# Altium schematic sheet DM3390_Connector_A.SchDoc: =project_title
size Tabloid; CompanyName: Luxonis Holding; Organization: Luxonis Holding; Address1: 1925 Harmony Park Drive; Address2: Westminster, CO; Address3: 80234; Address4: United States; SheetNumber: 7; SheetTotal: 12
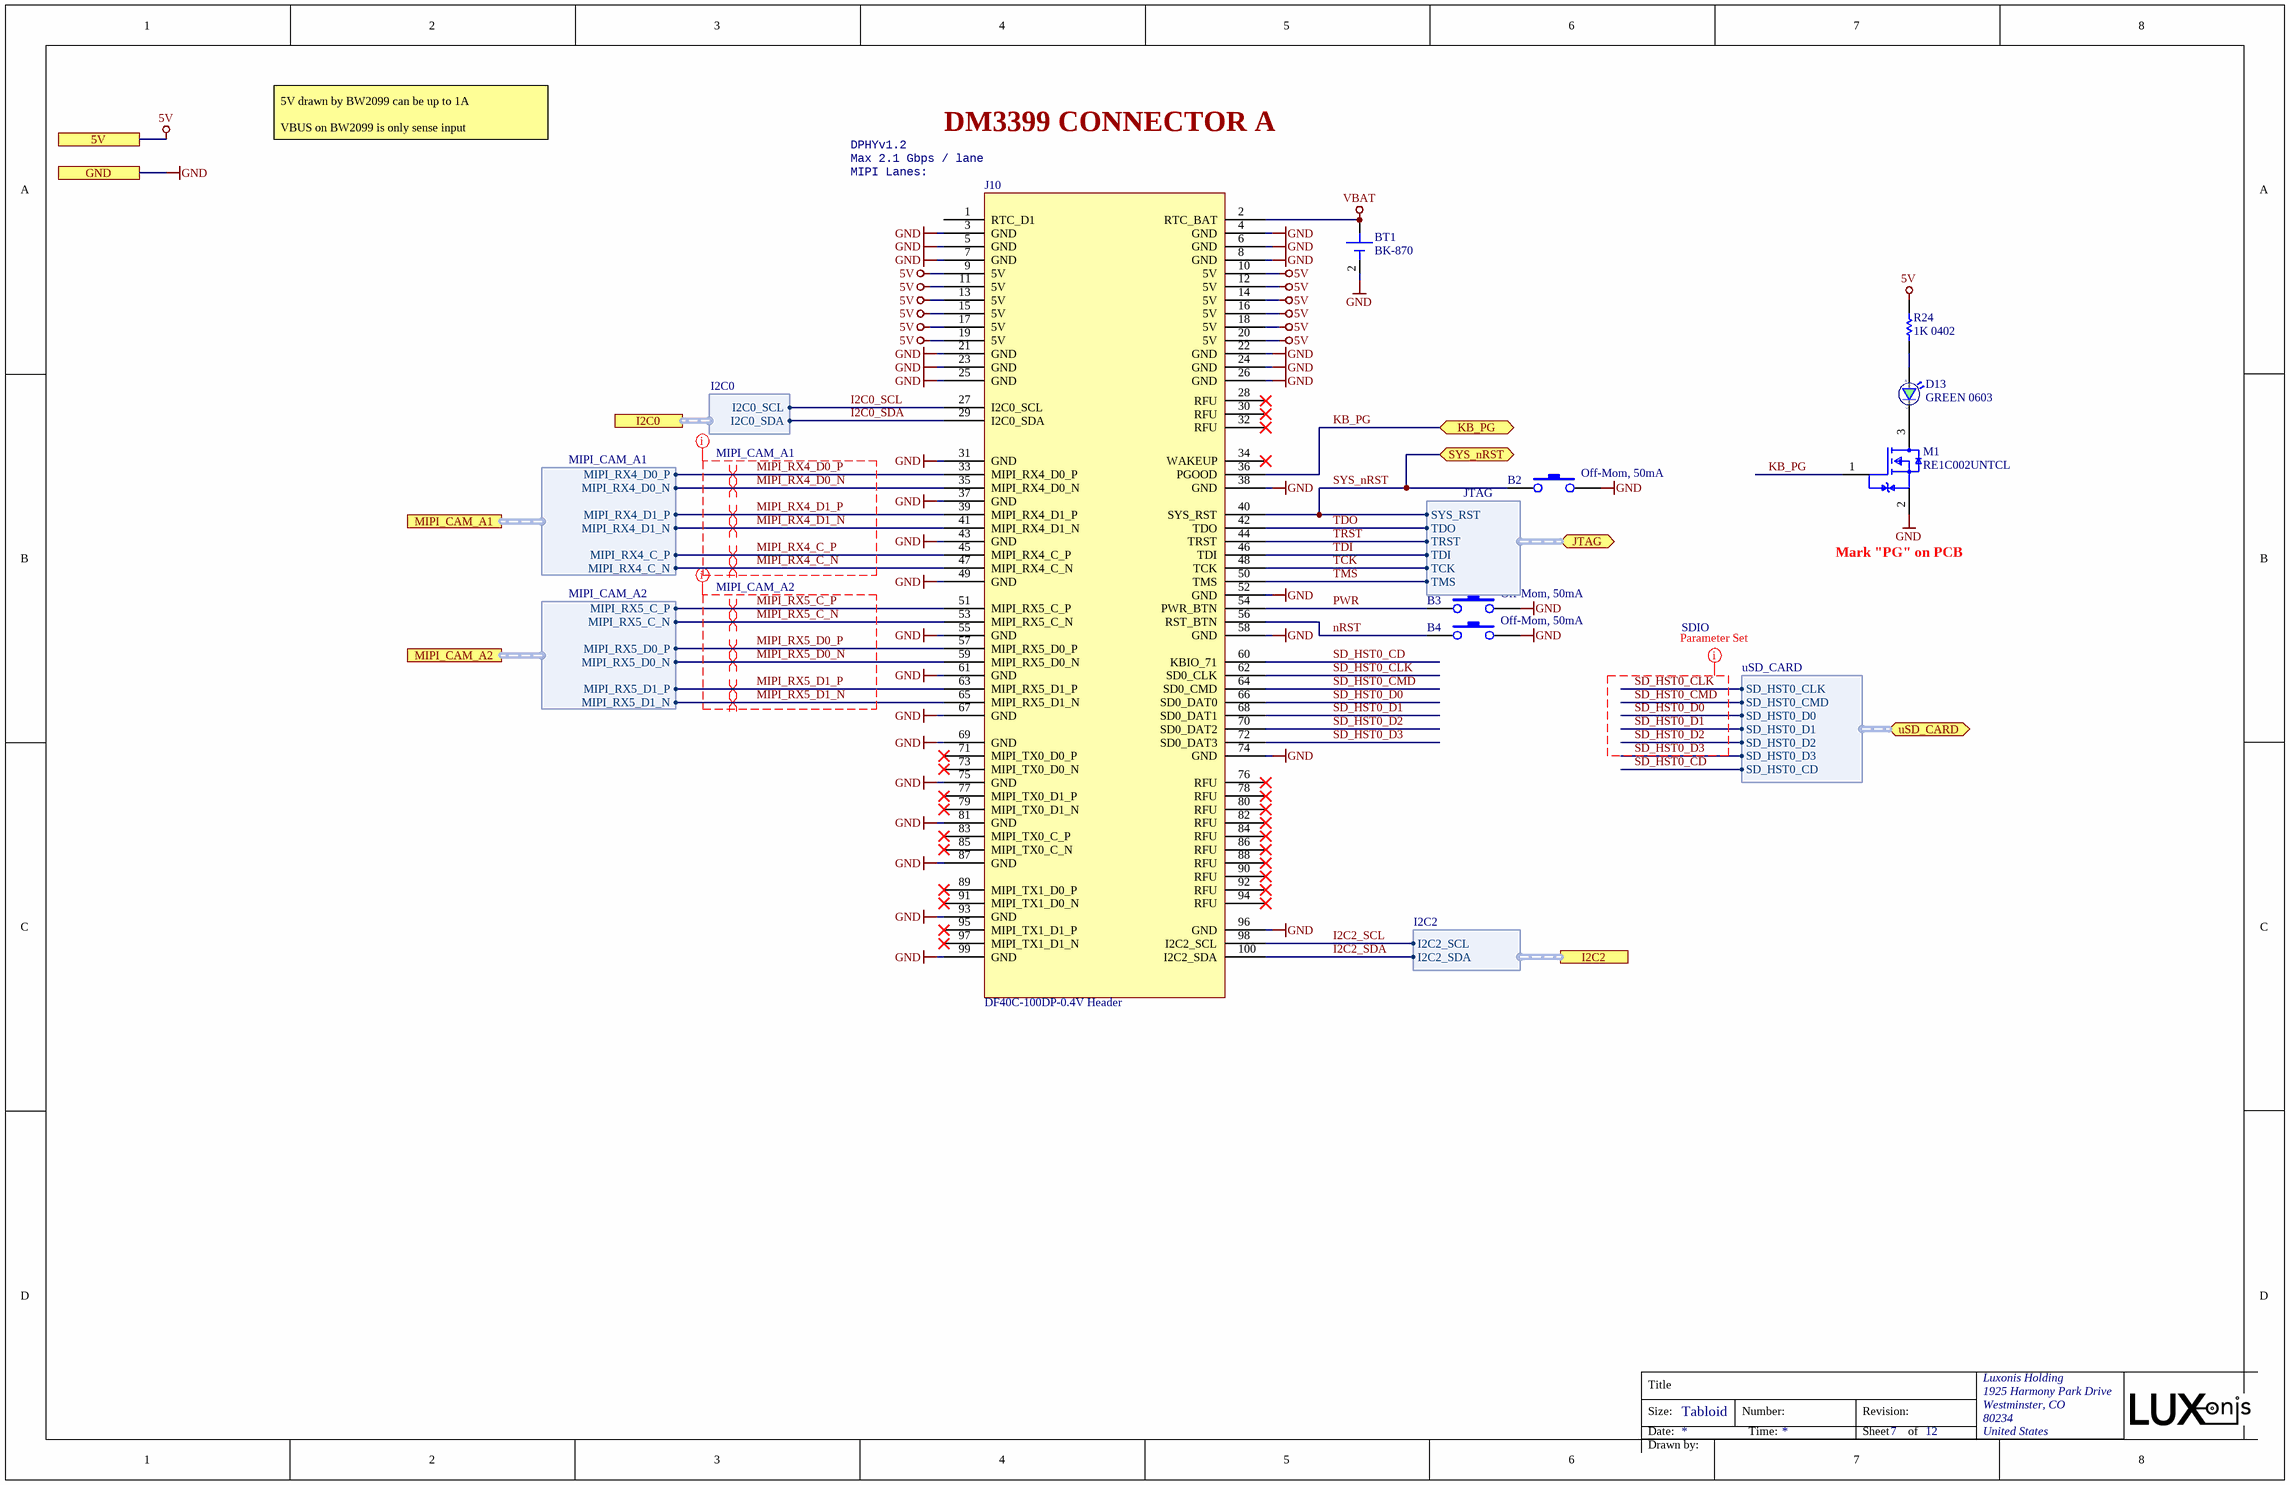
[diagram p0: DM3390_Connector_A.SchDoc]

## Parts
B2  Off-Mom, 50mA  [DTSM-32N-V]
B3  Off-Mom, 50mA  [DTSM-32N-V]
B4  Off-Mom, 50mA  [DTSM-32N-V]
BT1  BK-870  [MPD_BK-870]
D13  GREEN 0603  [SML_D1xx8W]
J10  DF40C-100DP-0.4V Header  [CON_A_SoM-MAX_DF40HC-3.0-100DS-0.4V_minpad]
M1  RE1C002UNTCL  [RE1C002UNTCL]
R24  1K 0402  [RESC0402(1005)_N]

## Ports
5V, GND, I2C0 (harness I2C0), I2C2 (harness I2C2), JTAG (bidir, harness JTAG), KB_PG (bidir), MIPI_CAM_A1 (harness MIPI_CAM_A1), MIPI_CAM_A2 (harness MIPI_CAM_A2), SYS_nRST (bidir), uSD_CARD (bidir, harness uSD_CARD)

## Harnesses
MIPI_CAM_A1: MIPI_RX4_D0_P, MIPI_RX4_D0_N, MIPI_RX4_D1_P, MIPI_RX4_D1_N, MIPI_RX4_C_P, MIPI_RX4_C_N
uSD_CARD: SD_HST0_CLK, SD_HST0_CMD, SD_HST0_D0, SD_HST0_D1, SD_HST0_D2, SD_HST0_D3, SD_HST0_CD
I2C2: I2C2_SDA, I2C2_SCL
MIPI_CAM_A2: MIPI_RX5_C_P, MIPI_RX5_C_N, MIPI_RX5_D0_P, MIPI_RX5_D0_N, MIPI_RX5_D1_P, MIPI_RX5_D1_N
I2C0: I2C0_SCL, I2C0_SDA
JTAG: SYS_RST, TDO, TRST, TDI, TCK, TMS

## Nets
5V: J10.9(5V) J10.10(5V) J10.11(5V) J10.12(5V) J10.13(5V) J10.14(5V) J10.15(5V) J10.16(5V) J10.17(5V) J10.18(5V) J10.19(5V) J10.20(5V) R24.2 ; port 5V
GND: B2.1 B3.1 B4.1 BT1.2(M) J10.3(GND) J10.4(GND) J10.5(GND) J10.6(GND) J10.7(GND) J10.8(GND) J10.21(GND) J10.22(GND) J10.23(GND) J10.24(GND) J10.25(GND) J10.26(GND) J10.31(GND) J10.37(GND) J10.38(GND) J10.43(GND) J10.49(GND) J10.52(GND) J10.55(GND) J10.58(GND) J10.61(GND) J10.67(GND) J10.69(GND) J10.74(GND) J10.75(GND) J10.81(GND) J10.87(GND) J10.93(GND) J10.96(GND) J10.99(GND) M1.2(Source) ; port GND
VBAT: BT1.1(P) BT1.3(P) J10.2(RTC_BAT)
I2C0_SCL: J10.27(I2C0_SCL) ; port I2C0.I2C0_SCL
I2C0_SDA: J10.29(I2C0_SDA) ; port I2C0.I2C0_SDA
I2C2_SCL: J10.98(I2C2_SCL) ; port I2C2.I2C2_SCL
I2C2_SDA: J10.100(I2C2_SDA) ; port I2C2.I2C2_SDA
KB_PG: J10.36(PGOOD) M1.1(Gate) ; port KB_PG
MIPI_RX4_C_N: J10.47(MIPI_RX4_C_N) ; port MIPI_CAM_A1.MIPI_RX4_C_N
MIPI_RX4_C_P: J10.45(MIPI_RX4_C_P) ; port MIPI_CAM_A1.MIPI_RX4_C_P
MIPI_RX4_D0_N: J10.35(MIPI_RX4_D0_N) ; port MIPI_CAM_A1.MIPI_RX4_D0_N
MIPI_RX4_D0_P: J10.33(MIPI_RX4_D0_P) ; port MIPI_CAM_A1.MIPI_RX4_D0_P
MIPI_RX4_D1_N: J10.41(MIPI_RX4_D1_N) ; port MIPI_CAM_A1.MIPI_RX4_D1_N
MIPI_RX4_D1_P: J10.39(MIPI_RX4_D1_P) ; port MIPI_CAM_A1.MIPI_RX4_D1_P
MIPI_RX5_C_N: J10.53(MIPI_RX5_C_N) ; port MIPI_CAM_A2.MIPI_RX5_C_N
MIPI_RX5_C_P: J10.51(MIPI_RX5_C_P) ; port MIPI_CAM_A2.MIPI_RX5_C_P
MIPI_RX5_D0_N: J10.59(MIPI_RX5_D0_N) ; port MIPI_CAM_A2.MIPI_RX5_D0_N
MIPI_RX5_D0_P: J10.57(MIPI_RX5_D0_P) ; port MIPI_CAM_A2.MIPI_RX5_D0_P
MIPI_RX5_D1_N: J10.65(MIPI_RX5_D1_N) ; port MIPI_CAM_A2.MIPI_RX5_D1_N
MIPI_RX5_D1_P: J10.63(MIPI_RX5_D1_P) ; port MIPI_CAM_A2.MIPI_RX5_D1_P
nRST: B4.2 J10.56(RST_BTN)
PWR: B3.2 J10.54(PWR_BTN)
SD_HST0_CD: J10.60(KBIO_71) ; port uSD_CARD.SD_HST0_CD
SD_HST0_CLK: J10.62(SD0_CLK) ; port uSD_CARD.SD_HST0_CLK
SD_HST0_CMD: J10.64(SD0_CMD) ; port uSD_CARD.SD_HST0_CMD
SD_HST0_D0: J10.66(SD0_DAT0) ; port uSD_CARD.SD_HST0_D0
SD_HST0_D1: J10.68(SD0_DAT1) ; port uSD_CARD.SD_HST0_D1
SD_HST0_D2: J10.70(SD0_DAT2) ; port uSD_CARD.SD_HST0_D2
SD_HST0_D3: J10.72(SD0_DAT3) ; port uSD_CARD.SD_HST0_D3
SYS_nRST: B2.2 J10.40(SYS_RST) ; port SYS_nRST, port JTAG.SYS_RST
TCK: J10.48(TCK) ; port JTAG.TCK
TDI: J10.46(TDI) ; port JTAG.TDI
TDO: J10.42(TDO) ; port JTAG.TDO
TMS: J10.50(TMS) ; port JTAG.TMS
TRST: J10.44(TRST) ; port JTAG.TRST
NetD13_1: D13.1(C) M1.3(Drain)
NetD13_2: D13.2(A) R24.1

Not connected (* = marked no-connect by the designer): J10 1(RTC_D1) 28(RFU)* 30(RFU)* 32(RFU)* 34(WAKEUP)* 71(MIPI_TX0_D0_P)* 73(MIPI_TX0_D0_N)* 76(RFU)* 77(MIPI_TX0_D1_P)* 78(RFU)* 79(MIPI_TX0_D1_N)* 80(RFU)* 82(RFU)* 83(MIPI_TX0_C_P)* 84(RFU)* 85(MIPI_TX0_C_N)* 86(RFU)* 88(RFU)* 89(MIPI_TX1_D0_P)* 90(RFU)* 91(MIPI_TX1_D0_N)* 92(RFU)* 94(RFU)* 95(MIPI_TX1_D1_P)* 97(MIPI_TX1_D1_N)*

## Layout directives
net class MIPI_CAM_A1; rule Matched Net Lengths [Delay Tolerance = 1ps]; rule Matched Net Lengths [Delay Tolerance = 0,5ps]: MIPI_RX4_C_N, MIPI_RX4_C_P, MIPI_RX4_D0_N, MIPI_RX4_D0_P, MIPI_RX4_D1_N, MIPI_RX4_D1_P
net class SDIO; rule Matched Net Lengths [Delay Tolerance = 20ps]: SD_HST0_CLK, SD_HST0_CMD, SD_HST0_D0, SD_HST0_D1, SD_HST0_D2, SD_HST0_D3
differential pair; differential pair class 100ohm: MIPI_RX4_C_N, MIPI_RX4_C_P, MIPI_RX4_D0_N, MIPI_RX4_D0_P, MIPI_RX4_D1_N, MIPI_RX4_D1_P, MIPI_RX5_C_N, MIPI_RX5_C_P, MIPI_RX5_D0_N, MIPI_RX5_D0_P, MIPI_RX5_D1_N, MIPI_RX5_D1_P
net class MIPI_CAM_A2; rule Matched Net Lengths [Delay Tolerance = 1ps]; rule Matched Net Lengths [Delay Tolerance = 0,5ps]: MIPI_RX5_C_N, MIPI_RX5_C_P, MIPI_RX5_D0_N, MIPI_RX5_D0_P, MIPI_RX5_D1_N, MIPI_RX5_D1_P

## Notes on the sheet
- 5V drawn by BW2099 can be up to 1A
  VBUS on BW2099 is only sense input
- Max 2.1 Gbps / lane
- DPHYv1.2
- DM3399 CONNECTOR A
- MIPI Lanes:
- Mark "PG" on PCB
- Title
- Size:
- Date:
- Tabloid
- Number:
- Time:
- Revision:
- Sheet
- of
- Drawn by:

## Library data of the parts
B2-B4 = DTSM-32N-V: SWITCH TACTILE SMT 3.5mm * 6mm , brown 160gf; Manufacturer 1: Diptronics; Manufacturer Part Number 1: DTSM-32N-V-T/R; Supplier 1: Mouser; Stock 1: 3199; Pricing 1: 1=0.38000, 10=0.38000, 50=0.31000, 100=0.28200, 500=0.25600, 1000=0.23600, 1600=0.20900, 4800=0.18800, 9600=0.17300, 10000=0.17300, 24000=0.16100 (USD); RoHS: No; Min Operating Temperature: -30°C; Max Operating Temperature: 80°C; Length: 6mm; Height: 5mm; Width: 3.5mm; ComponentLink1URL: https://datasheet.ciiva.com/29188/708548-da-01-en-tastschalter-smd-dtsm-32n-v-tr-1600st-29188823.pdf?src-supplier=Conrad; ComponentLink1Description: https://datasheet.ciiva.com/29188/708548-da-01-en-tastschalter-smd-dtsm-32n-v-tr-1600st-29188823.pdf?src-supplier=Conrad; Supplier Part Number 1: 113-DTSM32NVTR
BT1 = BK-870: Battery Retainer Coin 10MM SMD; Manufacturer 1: Memory Protection Devices; Number of Cells: 1; Supplier 1: Digi-Key; Manufacturer Part Number 1: BK-870; RoHS: Yes; Category: Uncategorized; Stock 1: 7093; Pricing 1: 1=0,57000, 10=0,48400, 50=0,42460, 100=0,40050, 250=0,36900, 500=0,34676, 1000=0,32451, 2500=0,29484, 5000=0,27445 (USD); Mount: Surface Mount,PCB; Termination: SMD/SMT; Package Quantity: 100; ComponentLink1URL: https://media.digikey.com/pdf/Data%20Sheets/Memory%20Protection%20PDFs/Coin_Cell_Guide.pdf?src-supplier=Digi-Key; ComponentLink1Description: https://media.digikey.com/pdf/Data%20Sheets/Memory%20Protection%20PDFs/Coin_Cell_Guide.pdf?src-supplier=Digi-Key; Supplier Part Number 1: BK-870-ND
D13 = SML-D12M8WT86: LED GREEN DIFFUSED 0603 SMD Green 572nm LED Indication - Discrete 2.2V 0603 (1608 Metric); Manufacturer: Rohm; Colour: Green,Yellow; Lens Colour: White,Clear,Diffused; Lens Style: Diffused,Colorless,Rectangular; Forward Current: 20mA; Luminous Intensity: 25mcd; Number of LEDs: 1; Viewing Angle: 160°; Lens Color: White,Diffused; Mount: Surface Mount; Case/Package: 0603; Number of Pins: 2; Case Code (Metric): 1608; Case Code (Imperial): 0603; Min Operating Temperature: -40°C; Max Operating Temperature: 85°C; Forward Voltage: 2.2V; Packaging: Tape and Reel; Dominant Wavelength: 572nm; Wavelength: 572nm; Illumination Colour: Green; Package Quantity: 1; Test Current: 20mA; Lens Transparency: Diffused; Length: 1.6mm; Height: 0.65mm; Width: 0.8mm; Radiation Hardening: No; REACH SVHC: Unknown; Lead Free: Lead Free; ComponentLink1URL: https://datasheet.ciiva.com/11774/0900766b80df3ada-11774260.pdf; ComponentLink1Description: https://datasheet.ciiva.com/11774/0900766b80df3ada-11774260.pdf; ComponentLink2URL: https://datasheet.ciiva.com/3161/sml-d1-3161419.pdf; ComponentLink2Description: https://datasheet.ciiva.com/3161/sml-d1-3161419.pdf; ComponentLink3URL: https://datasheet.ciiva.com/2110/sml-d1-2110396.pdf; ComponentLink3Description: https://datasheet.ciiva.com/2110/sml-d1-2110396.pdf; ComponentLink4URL: https://datasheet.ciiva.com/2110/sml-d1-2110397.pdf; ComponentLink4Description: https://datasheet.ciiva.com/2110/sml-d1-2110397.pdf; ComponentLink5URL: https://datasheet.ciiva.com/2110/sml-d1-2110398.pdf; ComponentLink5Description: https://datasheet.ciiva.com/2110/sml-d1-2110398.pdf; Manufacturer Part Number: SML-D12M8WT86; Supplier 1: Digi-Key; Manufacturer 1: Rohm; Manufacturer Part Number 1: SML-D12M8WT86; Stock 1: 112971; Pricing 1: 1=0.33000, 10=0.23900, 100=0.11340, 500=0.07560, 1000=0.05922 (USD); RoHS: Yes; Color: Green,Yellow; Illumination Color: Green; ComponentLink6URL: https://datasheet.ciiva.com/11774/0900766b80df3ada-11774260.pdf?src-supplier=RSComponents; ComponentLink6Description: https://datasheet.ciiva.com/11774/0900766b80df3ada-11774260.pdf?src-supplier=RSComponents; ComponentLink7URL: https://datasheet.ciiva.com/3161/sml-d1-3161419.pdf?src-supplier=Avnet; ComponentLink7Description: https://datasheet.ciiva.com/3161/sml-d1-3161419.pdf?src-supplier=Avnet; ComponentLink8URL: https://datasheet.ciiva.com/2110/sml-d1-2110396.pdf?src-supplier=Digi-Key; ComponentLink8Description: https://datasheet.ciiva.com/2110/sml-d1-2110396.pdf?src-supplier=Digi-Key; ComponentLink9URL: https://datasheet.ciiva.com/2110/sml-d1-2110397.pdf?src-supplier=Digi-Key; ComponentLink9Description: https://datasheet.ciiva.com/2110/sml-d1-2110397.pdf?src-supplier=Digi-Key; ComponentLink10URL: https://datasheet.ciiva.com/2110/sml-d1-2110398.pdf?src-supplier=Digi-Key; ComponentLink10Description: https://datasheet.ciiva.com/2110/sml-d1-2110398.pdf?src-supplier=Digi-Key; Supplier Part Number 1: 511-1578-1-ND
J10 = DF40HC(3.0)-100DS-0.4V_OAK-SoM-MAX_A: CONN HDR 100POS 0.4MM SMD GOLD BW2099 SYMBOL; Manufacturer Part Number 1: DF40C-100DP-0.4V(51); mfg: Hirose; mated_height: 1.5mm; pin_current: 0.3A; Number of Contacts: 100; Voltage Rating: 30V; Current Rating: 300mA; Connector Type: Plug; Contact Resistance: 90mR; Gender: Male; Mated Stacking Heights: 4mm; pin_pitch: 0.4mm; mating_connector: DF40C-100DP-0.4V; mfg_pn: DF40C-100DP-0.4V; Supplier 1: Digi-Key; Manufacturer 1: Hirose; Stock 1: 10165; Pricing 1: 1=1.66000, 10=1.50900, 25=1.41680, 50=1.35520, 100=1.29360, 250=1.17040, 500=1.07800, 1000=0.92400 (USD); RoHS: Yes; Mount: Surface Mount; Contact Plating: Gold; Contact Material: Bronze; Housing Color: Black; Housing Material: Polymer; Min Operating Temperature: -35°C; Max Operating Temperature: 85°C; Number of Rows: 2; Termination: SMD/SMT; Package Quantity: 1; Packaging: Tape and Reel; Number of Positions: 100; Orientation: Straight; Max Current Rating: 300mA; Max Voltage Rating (AC): 30V; Length: 21.52mm; Pitch: 0.4mm; Depth: 1.85mm; Stack Height: 1.5mm; Radiation Hardening: No; REACH SVHC: Unknown; Lead Free: Lead Free; ComponentLink1URL: https://datasheet.ciiva.com/26948/getdatasheetpartid-434445-26948932.pdf?src-supplier=Verical; ComponentLink1Description: https://datasheet.ciiva.com/26948/getdatasheetpartid-434445-26948932.pdf?src-supplier=Verical; ComponentLink2URL: https://datasheet.ciiva.com/46408/1824826-46408893.pdf?src-supplier=Element14; ComponentLink2Description: https://datasheet.ciiva.com/46408/1824826-46408893.pdf?src-supplier=Element14; ComponentLink3URL: http://datasheet.octopart.com/DF40C-100DP-0.4V%2851%29-Hirose-datasheet-12512482.pdf?src-supplier=Newark; ComponentLink3Description: http://datasheet.octopart.com/DF40C-100DP-0.4V%2851%29-Hirose-datasheet-12512482.pdf?src-supplier=Newark; ComponentLink4URL: http://datasheet.octopart.com/DF40C-100DP-0.4V%2851%29-Hirose-datasheet-24967586.pdf?src-supplier=Element14; ComponentLink4Description: http://datasheet.octopart.com/DF40C-100DP-0.4V%2851%29-Hirose-datasheet-24967586.pdf?src-supplier=Element14; ComponentLink5URL: http://datasheet.octopart.com/DF40C-100DP-0.4V%2851%29-Hirose-datasheet-8329537.pdf?src-supplier=Factory+Futures; ComponentLink5Description: http://datasheet.octopart.com/DF40C-100DP-0.4V%2851%29-Hirose-datasheet-8329537.pdf?src-supplier=Factory+Futures; ComponentLink6URL: http://datasheet.octopart.com/DF40C-100DP-0.4V%2851%29-Hirose-datasheet-62290554.pdf?src-supplier=Future+Electronics; ComponentLink6Description: http://datasheet.octopart.com/DF40C-100DP-0.4V%2851%29-Hirose-datasheet-62290554.pdf?src-supplier=Future+Electronics; ComponentLink7URL: http://datasheet.octopart.com/DF40C-100DP-0.4V%2851%29-Hirose-datasheet-130255728.pdf?src-supplier=Future+Electronics; ComponentLink7Description: http://datasheet.octopart.com/DF40C-100DP-0.4V%2851%29-Hirose-datasheet-130255728.pdf?src-supplier=Future+Electronics; Supplier Part Number 1: H11614CT-ND; Supplier 2: Mouser; Supplier Part Number 2: 798-DF40C100DP0.4V51
M1 = RE1C002UNTCL: MOSFET N-CH 20V 0.2A EMT3; Manufacturer 1: Rohm; Continuous Drain Current (ID): 200mA; Rds On Max: 1.2R; Input Capacitance: 25pF; Max Power Dissipation: 150mW; RoHS: Yes; Mount: Surface Mount; Case/Package: SOT-89; Packaging: Tape and Reel; Drain to Source Voltage (Vdss): 20V; Lead Free: Lead Free; ComponentLink1URL: http://www.mouser.com/ds/2/348/re1c002untcl-e-1018231.pdf?src-supplier=Mouser; ComponentLink1Description: http://www.mouser.com/ds/2/348/re1c002untcl-e-1018231.pdf?src-supplier=Mouser; ComponentLink2URL: http://rohmfs.rohm.com/en/techdata_basic/transistor/taping/EMT3_TL_taping.pdf?src-supplier=Digi-Key; ComponentLink2Description: http://rohmfs.rohm.com/en/techdata_basic/transistor/taping/EMT3_TL_taping.pdf?src-supplier=Digi-Key; ComponentLink3URL: http://rohmfs.rohm.com/en/products/databook/datasheet/discrete/transistor/mosfet/re1c002un.pdf?src-supplier=Avnet; ComponentLink3Description: http://rohmfs.rohm.com/en/products/databook/datasheet/discrete/transistor/mosfet/re1c002un.pdf?src-supplier=Avnet; ComponentLink4URL: https://www.rohm.com/datasheet/RE1C002UN/re1c002untcl-e?src-supplier=Digi-Key; ComponentLink4Description: https://www.rohm.com/datasheet/RE1C002UN/re1c002untcl-e?src-supplier=Digi-Key; ComponentLink5URL: http://www.farnell.com/datasheets/2704376.pdf?src-supplier=Newark; ComponentLink5Description: http://www.farnell.com/datasheets/2704376.pdf?src-supplier=Newark; ComponentLink6URL: http://www.farnell.com/datasheets/2704376.pdf?src-supplier=Farnell; ComponentLink6Description: http://www.farnell.com/datasheets/2704376.pdf?src-supplier=Farnell; ComponentLink7URL: http://www.farnell.com/datasheets/2704376.pdf?src-supplier=Element14; ComponentLink7Description: http://www.farnell.com/datasheets/2704376.pdf?src-supplier=Element14; Supplier 1: Digi-Key; Manufacturer Part Number 1: RE1C002UNTCL; Stock 1: 868886; Pricing 1: 1=0.20000, 10=0.18200, 100=0.09930, 500=0.06112, 1000=0.04167 (USD); Supplier Part Number 1: RE1C002UNTCLCT-ND
R24 = RC0402FR-071KL: RES SMD 1K OHM 1% 1/16W 0402 1 kOhms ±1% 0.063W, 1/16W Chip Resistor 0402 (1005 Metric) Moisture Resistant Thick Film; Manufacturer 1: Yageo; Temperature Coefficient: 100ppm/°C; Power Rating: 62.5mW; Voltage Rating (DC): 50V; Resistance: 1kR; RoHS: Yes; Number of Pins: 2; Case Code (Imperial): 0402; Case Code (Metric): 1005; Min Operating Temperature: -55°C; Max Operating Temperature: 155°C; Packaging: Tape and Reel; Composition: Thick Film; Voltage Rating: 50V; Military Standard: Not; Termination: SMD/SMT; Length: 1mm; Height: 0.32mm; Width: 0.5mm; Depth: 0.5mm; Lead Free: Lead Free; REACH SVHC: Unknown; ComponentLink1URL: https://datasheet.ciiva.com/11819/0900766b80c66297-11819477.pdf?src-supplier=RSComponents; ComponentLink1Description: https://datasheet.ciiva.com/11819/0900766b80c66297-11819477.pdf?src-supplier=RSComponents; ComponentLink2URL: https://datasheet.ciiva.com/12666/pyu-rc0402-51-rohs-l-6-r-12666741.pdf?src-supplier=Mouser; ComponentLink2Description: https://datasheet.ciiva.com/12666/pyu-rc0402-51-rohs-l-6-r-12666741.pdf?src-supplier=Mouser; ComponentLink3URL: https://datasheet.ciiva.com/17063/pyu-rc0402-51-rohs-l-6-r-17063193.pdf?src-supplier=Future+Electronics; ComponentLink3Description: https://datasheet.ciiva.com/17063/pyu-rc0402-51-rohs-l-6-r-17063193.pdf?src-supplier=Future+Electronics; ComponentLink4URL: https://datasheet.ciiva.com/22747/1018594-22747513.pdf?src-supplier=Element14; ComponentLink4Description: https://datasheet.ciiva.com/22747/1018594-22747513.pdf?src-supplier=Element14; ComponentLink5URL: https://datasheet.ciiva.com/7849/1018594-7849869.pdf?src-supplier=Element14; ComponentLink5Description: https://datasheet.ciiva.com/7849/1018594-7849869.pdf?src-supplier=Element14; ComponentLink6URL: https://datasheet.ciiva.com/7983/1018594-7983502.pdf?src-supplier=Element14; ComponentLink6Description: https://datasheet.ciiva.com/7983/1018594-7983502.pdf?src-supplier=Element14; ComponentLink7URL: https://datasheet.ciiva.com/7849/1018594-7849871.pdf?src-supplier=Element14; ComponentLink7Description: https://datasheet.ciiva.com/7849/1018594-7849871.pdf?src-supplier=Element14; Supplier 1: Digi-Key; Manufacturer Part Number 1: RC0402FR-071KL; Stock 1: 60695854; Pricing 1: 1=0.10000, 10=0.01600, 100=0.00670, 1000=0.00301, 2500=0.00261, 5000=0.00215 (USD); Case/Package: 0402; Tolerance: 1%; Supplier Part Number 1: 311-1.00KLRCT-ND